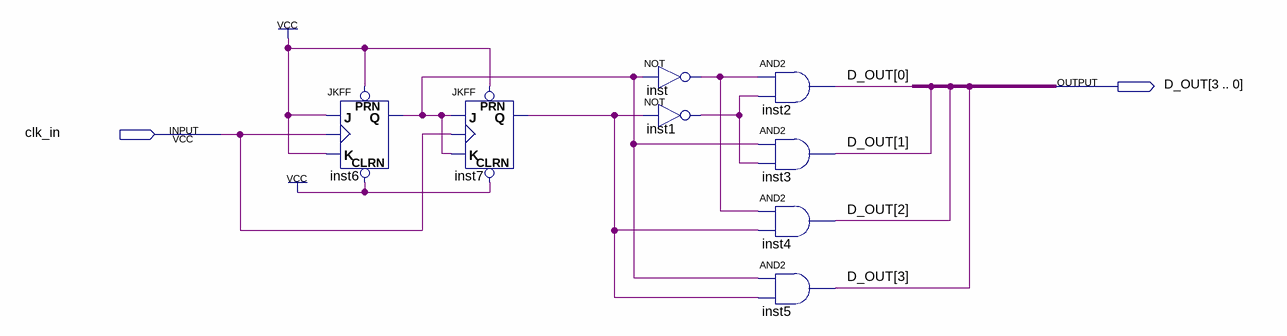
[diagram p0: schematic sheet]
// Quartus schematic demux.bdf as structural Verilog: 8 symbols, 2 pins
module demux (
  input  clk_in,
  output [3:0] D_OUT
);

  wire inst1_out, inst6_q, inst7_q, inst_out;

  JKFF inst6 (.PRN(1'b1), .CLRN(1'b1), .K(1'b1), .J(1'b1), .CLK(clk_in), .Q(inst6_q));
  JKFF inst7 (.PRN(1'b1), .CLRN(1'b1), .K(inst6_q), .J(inst6_q), .CLK(clk_in), .Q(inst7_q));
  not inst (inst_out, inst6_q);
  not inst1 (inst1_out, inst7_q);
  and inst2 (D_OUT[0], inst_out, inst1_out);
  and inst3 (D_OUT[1], inst6_q, inst1_out);
  and inst4 (D_OUT[2], inst_out, inst7_q);
  and inst5 (D_OUT[3], inst6_q, inst7_q);
endmodule
